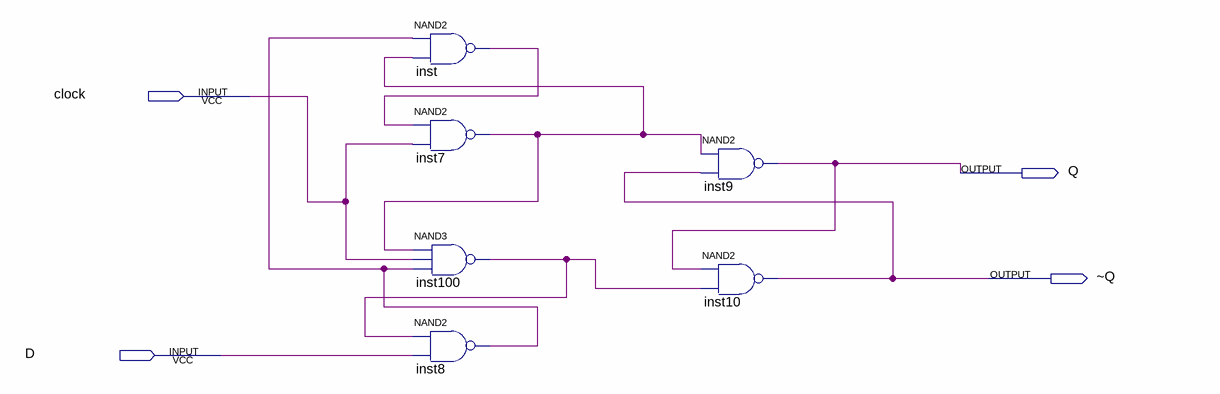
[diagram p0: schematic sheet]
// Quartus schematic lab9step5.bdf as structural Verilog: 6 symbols, 4 pins
module lab9step5 (
  input  clock,
  input  D,
  output Q,
  output \~Q 
);

  wire inst7_out, inst8_out, inst100_out, inst_out;

  nand inst (inst_out, inst8_out, inst7_out);
  nand inst7 (inst7_out, inst_out, clock);
  nand inst100 (inst100_out, inst7_out, clock, inst8_out);
  nand inst8 (inst8_out, inst100_out, D);
  nand inst9 (Q, inst7_out, \~Q );
  nand inst10 (\~Q , Q, inst100_out);
endmodule
